# Altium schematic sheet Redundant Power Supplies.SchDoc
size A4
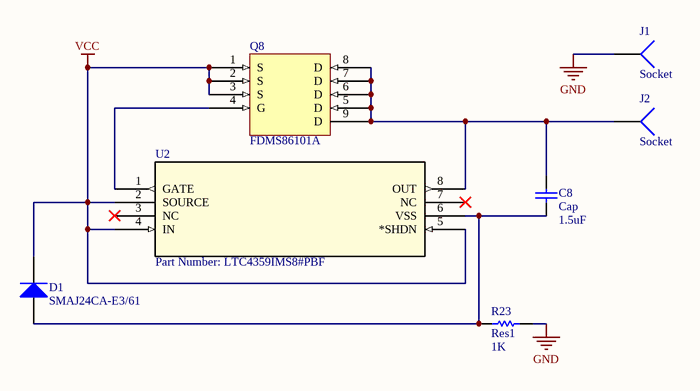
[diagram p0: Redundant Power Supplies.SchDoc]

## Parts
C8  Cap  value 1.5uF  [CAP_2012]
D1  SMAJ24CA-E3/61  [DIODE_DO-214AC]
J1  Socket  [PCBComponent_1]
J2  Socket  [PCBComponent_1]
Q8  FDMS86101A  [FDMS86101A]
R23  Res1  value 1K  [STA_RMCF2512]
U2  Part Number: LTC4359IMS8#PBF  [MSOP-8_MS]

## Nets
GND: J1.1 R23.2
VCC: D1.2(K) Q8.1(S) Q8.2(S) Q8.3(S) U2.2(SOURCE) U2.4(IN) U2.5(*SHDN)
NetC8_1: C8.1 D1.1(A) R23.1 U2.6(VSS)
NetC8_2: C8.2 J2.1 Q8.5(D) Q8.6(D) Q8.7(D) Q8.8(D) Q8.9(D) U2.8(OUT)
NetQ8_4: Q8.4(G) U2.1(GATE)

Not connected (* = marked no-connect by the designer): U2 3(NC)* 7(NC)*

## Library data of the parts
C8 = Cap: Capacitor; SPN: 445-7586-1-ND; Published: 8-Jun-2000; LatestRevisionDate: 17-Jul-2002; LatestRevisionNote: Re-released for DXP Platform.; PackageReference: RAD-0.3; Publisher: Altium Limited; PackageDescription: Radial Cap, Thru-Hole; 2 Leads; 0.3 in Pin Spacing
D1 = Diode: Default Diode; SPN: SMAJ24CA-E3/61GICT-ND; Published: 8-Jun-2000; LatestRevisionDate: 17-Jul-2002; LatestRevisionNote: Re-released for DXP Platform.; PackageVersion: Sep-1996; PackageReference: SMC; Publisher: Altium Limited; PackageDescription: DO-214-AB/SMC; 2 C-Bend Leads; Body 7.9 x 5.9 mm, inc. leads (LxW); Code_JEDEC: DO-214-AB
Q8 = FDMS86101A: MOSFET N-CH 100V 13A POWER56; SPN: FDMS86101ACT-ND
R23 = Res1: Resistor; SPN: RMCF2512JT1K00CT-ND; Published: 8-Jun-2000; LatestRevisionDate: 17-Jul-2002; LatestRevisionNote: Re-released for DXP Platform.; PackageReference: AXIAL-0.3; Publisher: Altium Limited; PackageDescription: Axial Device, Thru-Hole; 2 Leads; 0.3 in Pin Spacing
U2 = LTC4359IMS8#PBF: No Description Available; Vendor: Linear Technology; Built_By: EMA_UL_Team; Manufacturer_Part_Number: LTC4359IMS8#PBF; Copyright: Copyright (C) 2018 Accelerated Designs. All rights reserved; RefDes: RefDes; Type: DEV; Value: Value
J1 J2 = Socket: LatestRevisionDate: 17-Jul-2002; LatestRevisionNote: Re-released for DXP Platform.; Publisher: Altium Limited